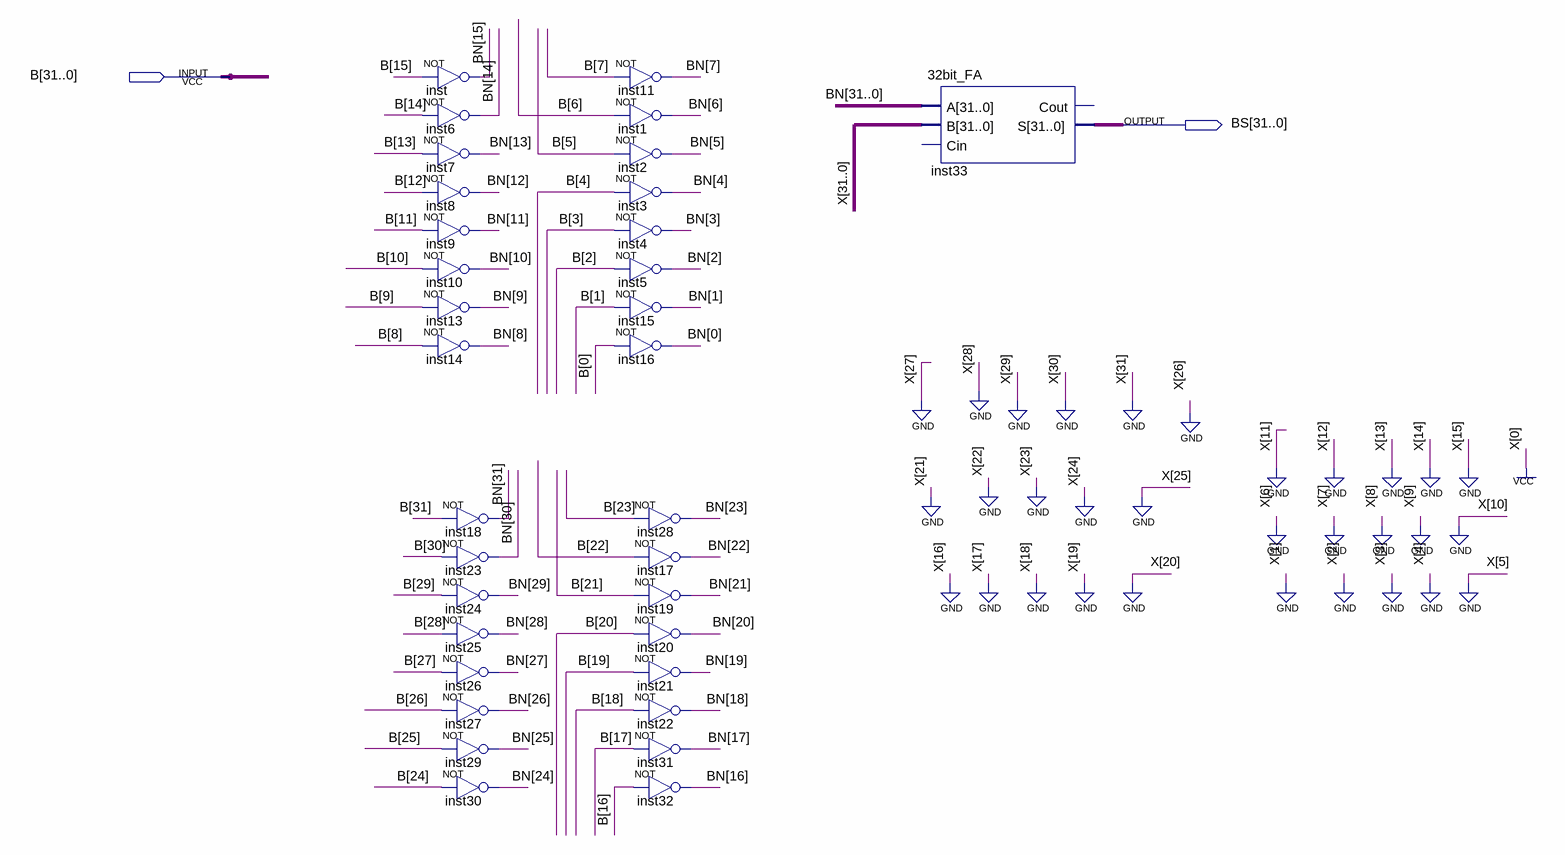
[diagram p0: schematic sheet]
// Quartus schematic bu2_32.bdf as structural Verilog: 33 symbols, 2 pins
module bu2_32 (
  input  [31:0] B,
  output [31:0] BS
);

  wire [31:0] BN;

  not inst (BN[15], B[15]);
  not inst6 (BN[14], B[14]);
  not inst7 (BN[13], B[13]);
  not inst8 (BN[12], B[12]);
  not inst9 (BN[11], B[11]);
  not inst10 (BN[10], B[10]);
  not inst13 (BN[9], B[9]);
  not inst14 (BN[8], B[8]);
  not inst18 (BN[31], B[31]);
  not inst23 (BN[30], B[30]);
  not inst24 (BN[29], B[29]);
  not inst25 (BN[28], B[28]);
  not inst26 (BN[27], B[27]);
  not inst27 (BN[26], B[26]);
  not inst29 (BN[25], B[25]);
  not inst30 (BN[24], B[24]);
  not inst11 (BN[7], B[7]);
  not inst1 (BN[6], B[6]);
  not inst2 (BN[5], B[5]);
  not inst3 (BN[4], B[4]);
  not inst4 (BN[3], B[3]);
  not inst5 (BN[2], B[2]);
  not inst15 (BN[1], B[1]);
  not inst16 (BN[0], B[0]);
  not inst28 (BN[23], B[23]);
  not inst17 (BN[22], B[22]);
  not inst19 (BN[21], B[21]);
  not inst20 (BN[20], B[20]);
  not inst21 (BN[19], B[19]);
  not inst22 (BN[18], B[18]);
  not inst31 (BN[17], B[17]);
  not inst32 (BN[16], B[16]);
  \32bit_FA  inst33 (.A(BN), .B(32'b00000000000000000000000000000001), .S(BS));  // open: Cin, Cout
endmodule
